# EAGLE schematic ArduinoISP (EAGLE 6.4)
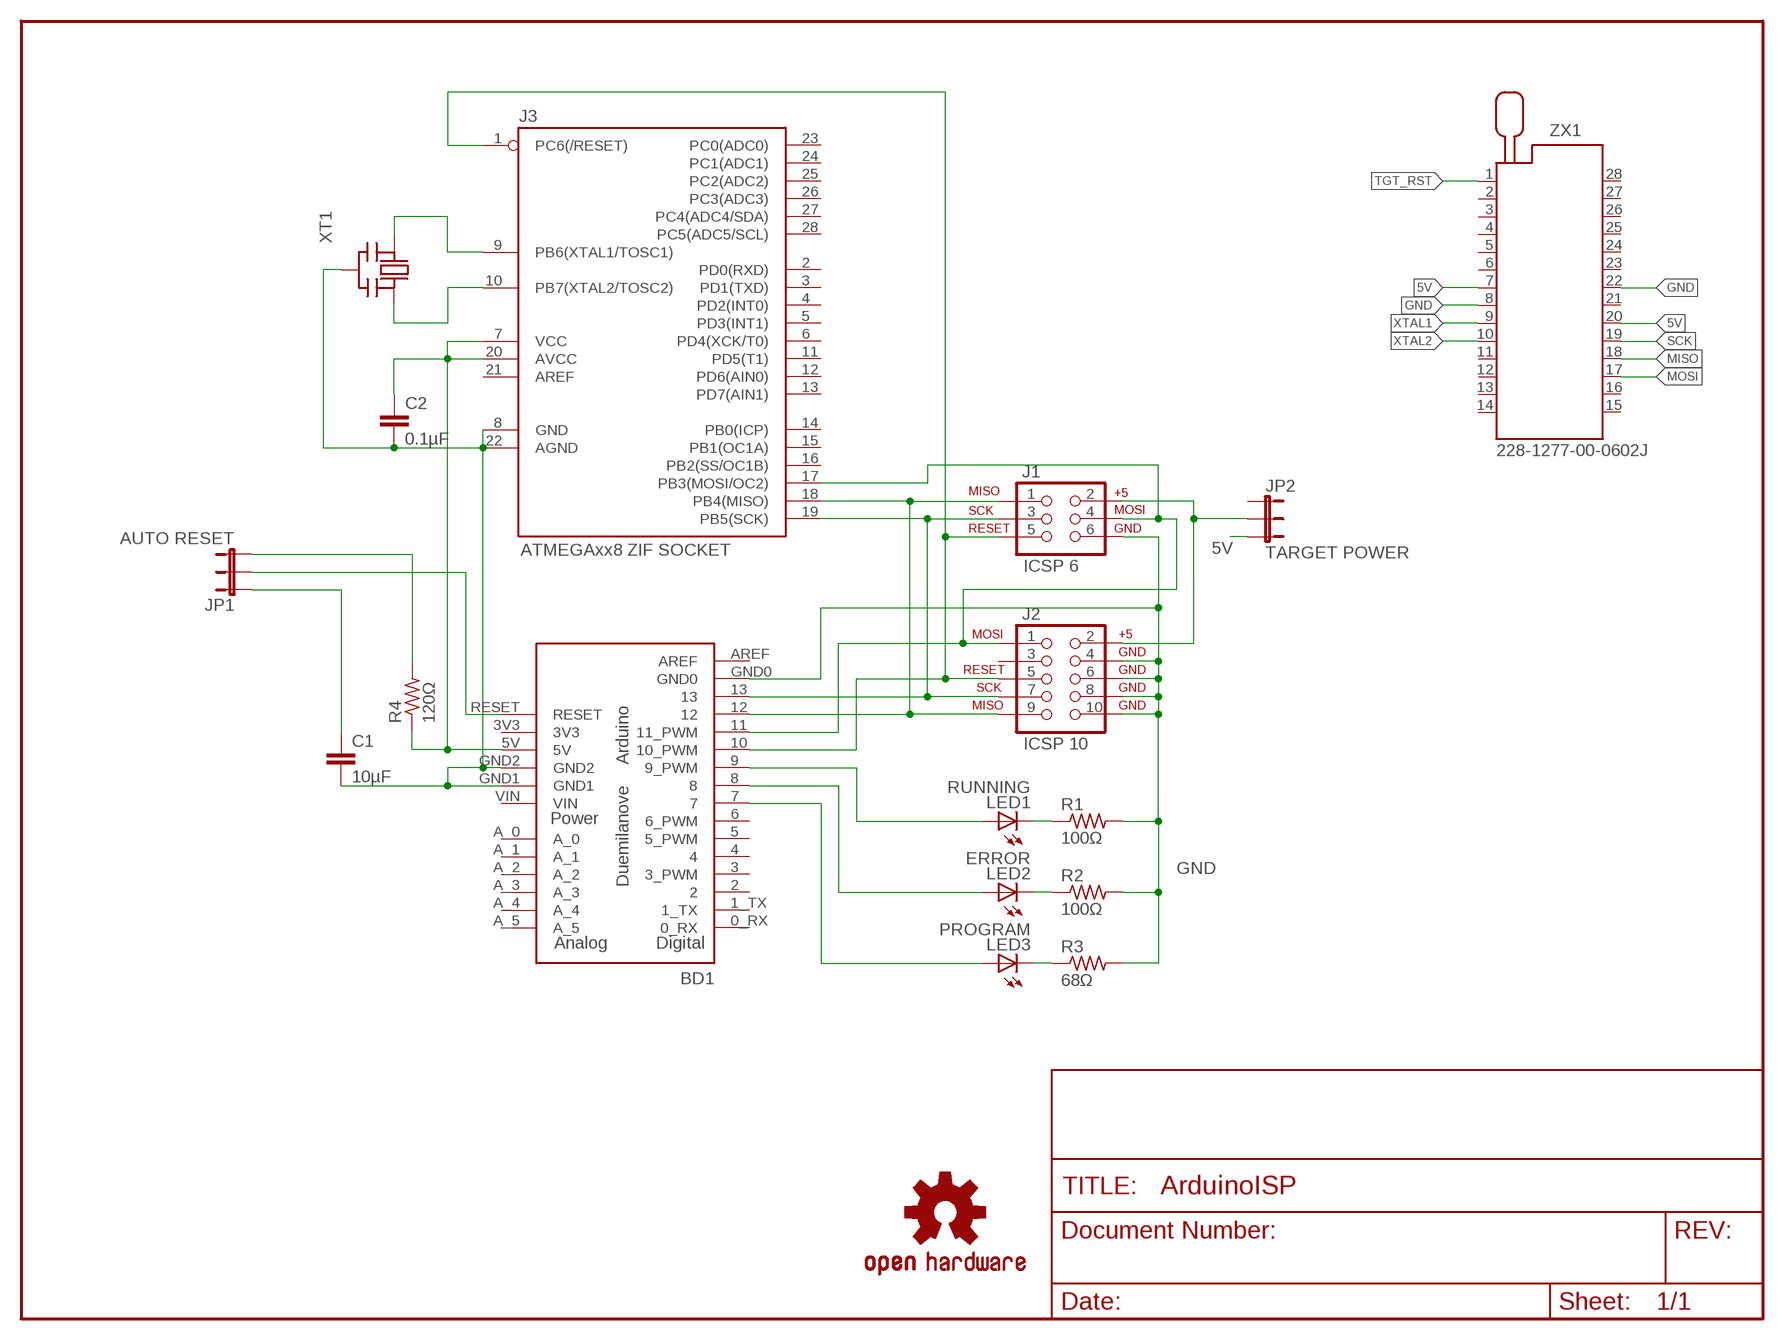
[diagram p0: schematic, sheet 1]

## Parts
BD1  ARDUINO-USBOCTAGONAL_PADS  [SHIELD-OCTAGONALPAD]
C1  10µF  C-EU050-055X075  [C050-055X075]
C2  0.1µF  C-EU025-024X044  [C025-024X044]
J1  ICSP 6  AVR_SPI_PRG_6NS  [2X3-NS]
J2  ICSP 10  AVR_SPI_PROG2PTH  [AVR_ICSP]
J3  ATMEGAxx8 ZIF SOCKET  AVR-MEGA8-PZIF_SOCKET  [DIL28-3-ZIF_SOCKET]
JP1  AUTO RESET  JUMPER-3PTH  [1X03]
JP2  TARGET POWER  JUMPER-3PTH  [1X03]
LED1  RUNNING  LED5MM  [LED5MM]
LED2  ERROR  LED5MM  [LED5MM]
LED3  PROGRAM  LED5MM  [LED5MM]
R1  100Ω  R-US_0204/7  [0204/7]
R2  100Ω  R-US_0204/7  [0204/7]
R3  68Ω  R-US_0204/7  [0204/7]
R4  120Ω  R-US_0204/7  [0204/7]
U$2  OSHW-LOGOM  [OSHW-LOGO-M]
XT1  CERMOSCILL-THM  [CERM_OSC]
ZX1  228-1277-00-0602J  [228-1277-00-0602J]

## Nets
5V: BD1.5V C2.1 J3.7(VCC) J3.20(AVCC) JP2.3 R4.1 ZX1.7 ZX1.20
5V_COND: J1.2 J2.2 JP2.2
ERRLED: BD1.8 LED2.A
ERRLEDCATH: LED2.K(C) R2.1
GND: BD1.GND0 BD1.GND1 BD1.GND2 C1.2 C2.2 J1.6 J2.4 J2.6 J2.8 J2.10 J3.8(GND) J3.22(AGND) R1.2 R2.2 R3.2 XT1.P$2(GND) ZX1.8 ZX1.22
MISO: BD1.12 J1.1 J2.9 J3.18(PB4(MISO)) ZX1.18
MOSI: BD1.11(11_PWM) J1.4 J2.1 J3.17(PB3(MOSI/OC2)) ZX1.17
NG_AR_FIX: JP1.3 R4.2
PRGLED: BD1.7 LED3.A
PRGLEDCATH: LED3.K(C) R3.1
RESET: BD1.RESET JP1.2
RUNLED: BD1.9(9_PWM) LED1.A
RUNLEDCATH: LED1.K(C) R1.1
SCK: BD1.13 J1.3 J2.7 J3.19(PB5(SCK)) ZX1.19
TGT_RST: BD1.10(10_PWM) J1.5 J2.5 J3.1(PC6(/RESET)) ZX1.1
UNO_AR_FIX: C1.1 JP1.1
XTAL1: J3.9(PB6(XTAL1/TOSC1)) XT1.P$1(IN) ZX1.9
XTAL2: J3.10(PB7(XTAL2/TOSC2)) XT1.P$3(OUT) ZX1.10
Unconnected: BD1.0_RX BD1.1_TX BD1.2 BD1.3(3_PWM) BD1.4 BD1.5(5_PWM) BD1.6(6_PWM) BD1.A_0 BD1.A_1 BD1.A_2 BD1.A_3 BD1.A_4 BD1.A_5 BD1.AREF J2.3 J3.2(PD0(RXD)) J3.3(PD1(TXD)) J3.4(PD2(INT0)) J3.5(PD3(INT1)) J3.6(PD4(XCK/T0)) J3.11(PD5(T1)) J3.12(PD6(AIN0)) J3.13(PD7(AIN1)) J3.14(PB0(ICP)) J3.15(PB1(OC1A)) J3.16(PB2(SS/OC1B)) J3.21(AREF) J3.23(PC0(ADC0)) J3.24(PC1(ADC1)) J3.25(PC2(ADC2)) J3.26(PC3(ADC3)) J3.27(PC4(ADC4/SDA)) J3.28(PC5(ADC5/SCL)) JP2.1 ZX1.2 ZX1.3 ZX1.4 ZX1.5 ZX1.6 ZX1.11 ZX1.12 ZX1.13 ZX1.14 ZX1.15 ZX1.16 ZX1.21 ZX1.23 ZX1.24 ZX1.25 ZX1.26 ZX1.27 ZX1.28

## Power pins joined to a net without a drawn wire
3V3: BD1.3V3
VIN: BD1.VIN

## Library data of the parts
BD1 = Arduino-Various:ARDUINO-USB: The Ardiuno Duemilanove Pinouts layoutet as a Bare Shield. v0.5 Also for Arduino Diecimila. This is designed as a Part and has no Outline in the Dimension Layer. The Outline, when present, is drawed at the tPlace / bPlace Layer. Library by Stephanie Lange, http://www.k-ita.de/~sl/
C1 C2 = resistor:C-EU: CAPACITOR, European symbol
J1 = SparkFun:AVR_SPI_PRG_6: AVR ISP 6 Pin This is the reduced ISP connector for AVR programming. Common on Arduino. This footprint will take up less PCB space and can be used with a 10-pin to 6-pin adapter such as SKU: BOB-08508
J2 = SparkFun:AVR_SPI_PROG2: AVR ICSP Header This is the standard AVR In Circuit Serial Programming header. Minimal, but includes pin one indicator. Works with standard Olimex programmers. Also look for the 6-pin reduced version. Spark Fun Electronics SKU: PRT-00778
J3 = SparkFun:AVR-MEGA8-P: MICROCONTROLLER 8 Kbytes FLASH 1 kbytes SRAM 512 bytes EEPROM USART 4-channel 10 bit ADC 2-channel 8 bit ADC
JP1 JP2 = SparkFun:JUMPER-3
LED1-LED3 = adafruit:LED: LED OSRAM: - CHIPLED LG R971, LG N971, LY N971, LG Q971, LY Q971, LO R971, LY R971 LH N974, LH R974 LS Q976, LO Q976, LY Q976 LO Q996 - Hyper CHIPLED LW Q18S LB Q993, LB Q99A, LB R99A - SideLED LS A670, LO A670, LY A670, LG A670, LP A670 LB A673, LV A673, LT A673, LW A673 LH A674 LY A675 LS A676, LA A676, LO A676, LY A676, LW A676 LS A679, LY A679, LG A679 - Hyper Micro SIDELED® LS Y876, LA Y876, LO Y876, LY Y876 LT Y87S - SmartLED LW L88C, LW L88S LB L89C, LB L89S, LG L890 LS L89K, LO L89K, LY L89K LS L896, LA L896, LO L896, LY L896 - TOPLED LS T670, LO T670, LY T670, LG T670, LP T670 LSG T670, LSP T670, LSY T670, LOP T670, LYG T670 LG T671, LOG T671, LSG T671 LB T673, LV T673, LT T673, LW T673 LH T674 LS T676, LA T676, LO T676, LY T676, LB T676, LH T676, LSB T676, LW T676 LB T67C, LV T67C, LT T67C, LS T67K, LO T67K, LY T67K, LW E67C LS E67B, LA E67B, LO E67B, LY E67B, LB E67C, LV E67C, LT E67C LW T67C LS T679, LY T679, LG T679 LS T770, LO T770, LY T770, LG T770, LP T770 LB T773, LV T773, LT T773, LW T773 LH T774 LS E675, LA E675, LY E675, LS T675 LS T776, LA T776, LO T776, LY T776, LB T776 LHGB T686 LT T68C, LB T68C - Hyper Mini TOPLED® LB M676 - Mini TOPLED Santana® LG M470 LS M47K, LO M47K, LY M47K Source: http://www.osram.convergy.de/
R1-R4 = adafruit:R-US_: RESISTOR, American symbol
U$2 = SparkFun:OSHW-LOGO: Open Source Hardware Logo This logo indicates the piece of hardware it is found on incorporates a OSHW license and/or adheres to the definition of open source hardware found here: http://freedomdefined.org/OSHW
XT1 = adafruit:CERMOSCILL: Ceramic oscillator with built in capacitors such as ZTT-12MHz http://www.ladyada.net/library/eagle
ZX1 = con-3m:228-?00-0602J: Zero Insertion Force Socked Source: http://www.3M.com/ehpd; MF: 3M; MPN: 228-1277-00-0602J; OC_FARNELL: 9897356; OC_NEWARK: 85K7825